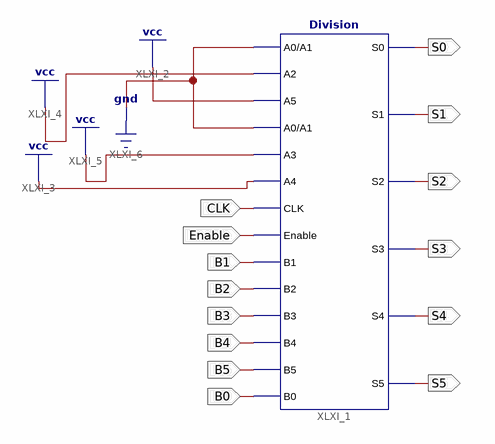
[diagram p0: schematic sheet 1]
// Xilinx ISE schematic FullDiv.sch (spartan3e) as structural Verilog: 1 symbols, 14 ports
module FullDiv (
  input  CLK,
  input  Enable,
  input  B1,
  input  B2,
  input  B3,
  input  B4,
  input  B5,
  input  B0,
  output S5,
  output S4,
  output S3,
  output S2,
  output S1,
  output S0
);

  Division XLXI_1 (
    .A0(1'b0), .A2(1'b1), .A5(1'b1), .A1(1'b0), .A3(1'b1), .A4(1'b1), .CLK(CLK), .Enable(Enable), .B1(B1),
    .B2(B2), .B3(B3), .B4(B4), .B5(B5), .B0(B0), .S0(S0), .S1(S1), .S2(S2), .S3(S3), .S4(S4), .S5(S5));
endmodule
